# Altium project MainBoard.PrjPcb
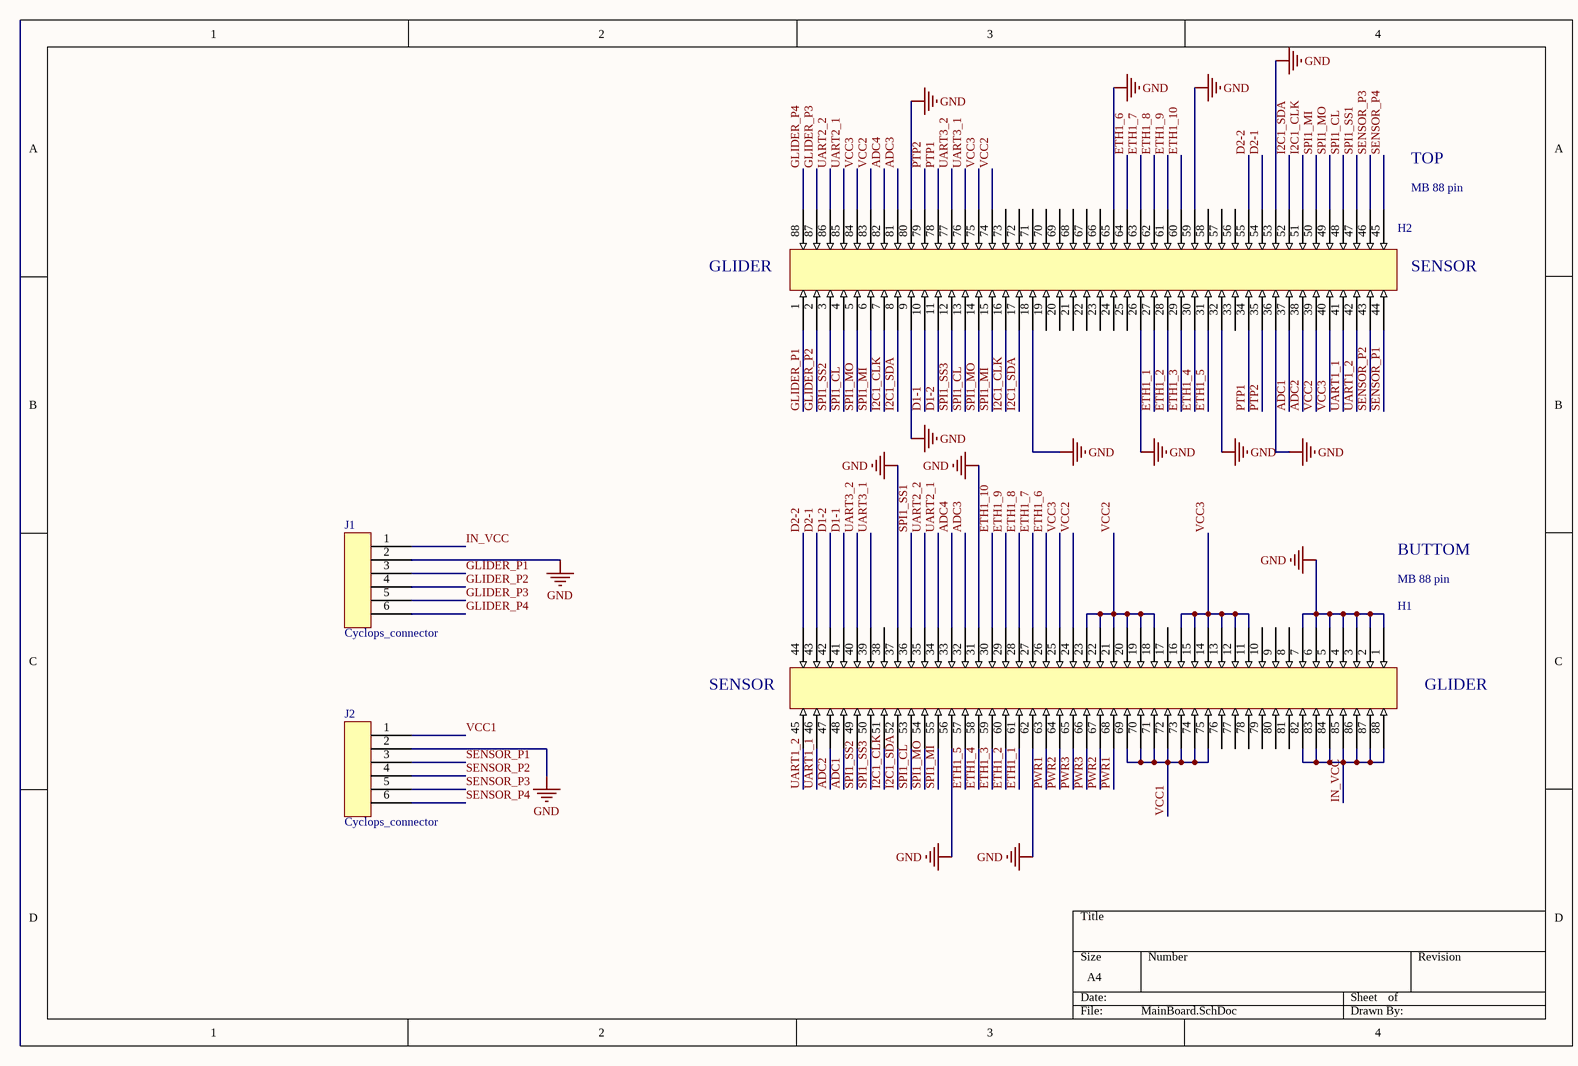
[diagram p0: MainBoard.SchDoc]
1 sheet, 4 parts. Net scope: global (net labels, ports and power ports of the same name join across sheets).
Board file: MainBoard.PcbDoc

## Sheet MainBoard.SchDoc
size A4

### Parts
H1  MB 88 pin  [MB 88 pins]
H2  MB 88 pin  [MB 88 pins]
J1  Cyclops_connector  [CYCLOPS-1LINE]
J2  Cyclops_connector  [CYCLOPS-1LINE]

### Nets
GND: H1.1 H1.2 H1.3 H1.4 H1.5 H1.6 H1.7 H1.31 H1.37 H1.56 H1.62 H2.9 H2.18 H2.26 H2.32 H2.36 H2.53 H2.59 H2.65 H2.80 J1.2 J2.2
ADC1: H1.48 H2.37
ADC2: H1.47 H2.38
ADC3: H1.32 H2.81
ADC4: H1.33 H2.82
D1-1: H1.41 H2.10
D1-2: H1.42 H2.11
D2-1: H1.43 H2.54
D2-2: H1.44 H2.55
ETH1_1: H1.61 H2.27
ETH1_2: H1.60 H2.28
ETH1_3: H1.59 H2.29
ETH1_4: H1.58 H2.30
ETH1_5: H1.57 H2.31
ETH1_6: H1.26 H2.64
ETH1_7: H1.27 H2.63
ETH1_8: H1.28 H2.62
ETH1_9: H1.29 H2.61
ETH1_10: H1.30 H2.60
GLIDER_P1: H2.1 J1.3
GLIDER_P2: H2.2 J1.4
GLIDER_P3: H2.87 J1.5
GLIDER_P4: H2.88 J1.6
I2C1_CLK: H1.51 H2.7 H2.16 H2.51
I2C1_SDA: H1.52 H2.8 H2.17 H2.52
IN_VCC: H1.82 H1.83 H1.84 H1.85 H1.86 H1.87 H1.88 J1.1
PTP1: H2.34 H2.78
PTP2: H2.35 H2.79
PWR1: H1.63 H1.68
PWR2: H1.64 H1.67
PWR3: H1.65 H1.66
SENSOR_P1: H2.44 J2.3
SENSOR_P2: H2.43 J2.4
SENSOR_P3: H2.46 J2.5
SENSOR_P4: H2.45 J2.6
SPI1_CL: H1.53 H2.4 H2.13 H2.48
SPI1_MI: H1.55 H2.6 H2.15 H2.50
SPI1_MO: H1.54 H2.5 H2.14 H2.49
SPI1_SS1: H1.36 H2.47
SPI1_SS2: H1.49 H2.3
SPI1_SS3: H1.50 H2.12
UART1_1: H1.46 H2.41
UART1_2: H1.45 H2.42
UART2_1: H1.34 H2.85
UART2_2: H1.35 H2.86
UART3_1: H1.39 H2.76
UART3_2: H1.40 H2.77
VCC1: H1.69 H1.70 H1.71 H1.72 H1.73 H1.74 H1.75 J2.1
VCC2: H1.18 H1.19 H1.20 H1.21 H1.22 H1.23 H1.24 H2.39 H2.74 H2.83
VCC3: H1.11 H1.12 H1.13 H1.14 H1.15 H1.16 H1.25 H2.40 H2.75 H2.84

Not connected (* = marked no-connect by the designer): H1 8 9 10 17 38 76 77 78 79 80 81; H2 19 20 21 22 23 24 25 33 56 57 58 66 67 68 69 70 71 72 73

### Notes on the sheet
- TOP
- (near H2) GLIDER
- (near H2) SENSOR
- BUTTOM
- (near H1) SENSOR
- (near H1) GLIDER